# Altium schematic sheet 0_Overview.SchDoc
size A4; SheetNumber: 1; SheetTotal: 6
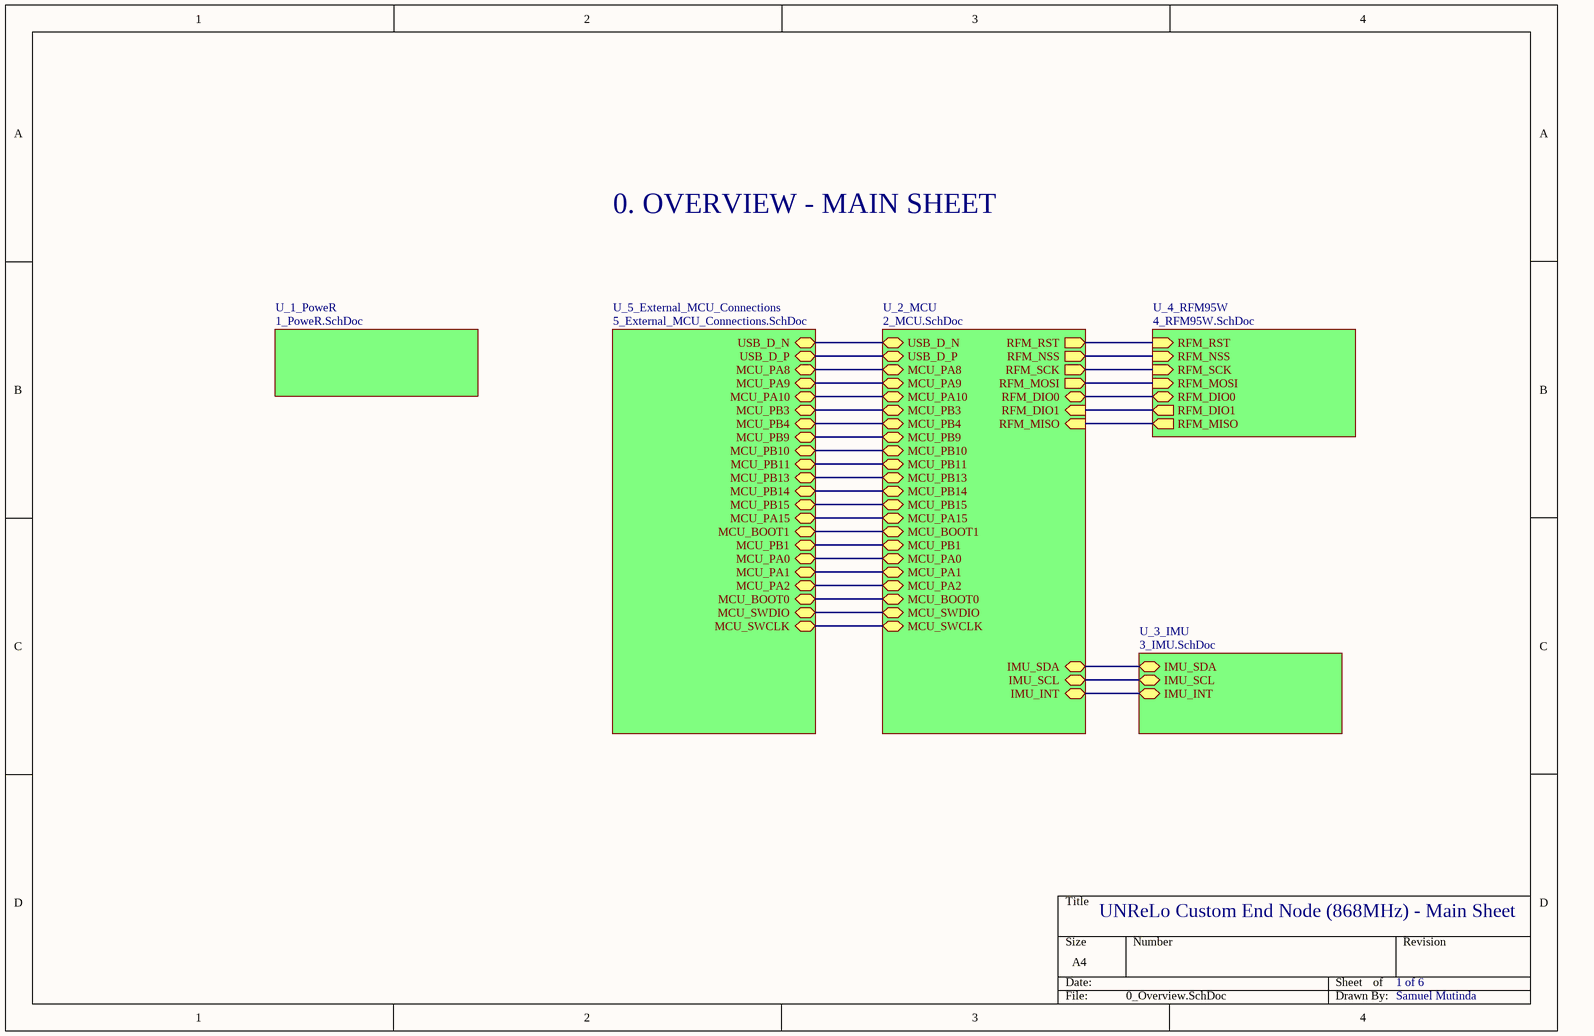
[diagram p0: 0_Overview.SchDoc]

## Sub-sheets
U_1_PoweR = 1_PoweR.SchDoc: no entries
U_2_MCU = 2_MCU.SchDoc: RFM_DIO0 (bidir), RFM_RST (out), RFM_NSS (out), RFM_SCK (out), RFM_MOSI (out), RFM_MISO (in), RFM_DIO1 (in), USB_D_N (bidir), USB_D_P (bidir), MCU_PA8 (bidir), MCU_PA9 (bidir), MCU_PA10 (bidir), MCU_PB3 (bidir), MCU_PB4 (bidir), MCU_PB9 (bidir), MCU_PB10 (bidir), MCU_PB11 (bidir), MCU_PB13 (bidir), MCU_PB14 (bidir), MCU_PB15 (bidir), MCU_PA15 (bidir), MCU_BOOT1 (bidir), MCU_PB1 (bidir), MCU_PA0 (bidir), MCU_PA1 (bidir), MCU_PA2 (bidir), MCU_BOOT0 (bidir), MCU_SWDIO (bidir), MCU_SWCLK (bidir), IMU_SCL (bidir), IMU_SDA (bidir), IMU_INT (bidir)
U_3_IMU = 3_IMU.SchDoc: IMU_SDA (bidir), IMU_SCL (bidir), IMU_INT (bidir)
U_4_RFM95W = 4_RFM95W.SchDoc: RFM_RST (in), RFM_NSS (in), RFM_SCK (in), RFM_MOSI (in), RFM_MISO (out), RFM_DIO0 (bidir), RFM_DIO1 (out)
U_5_External_MCU_Connections = 5_External_MCU_Connections.SchDoc: USB_D_N (bidir), USB_D_P (bidir), MCU_PA0 (bidir), MCU_PA1 (bidir), MCU_PA2 (bidir), MCU_PB1 (bidir), MCU_PB9 (bidir), MCU_PB10 (bidir), MCU_PB11 (bidir), MCU_PB13 (bidir), MCU_PB14 (bidir), MCU_PB15 (bidir), MCU_PB3 (bidir), MCU_PB4 (bidir), MCU_PA10 (bidir), MCU_PA9 (bidir), MCU_PA8 (bidir), MCU_BOOT0 (bidir), MCU_BOOT1 (bidir), MCU_SWDIO (bidir), MCU_SWCLK (bidir), MCU_PA15 (bidir)

## Nets
(unnamed): sheet U_2_MCU/RFM_DIO0, sheet U_4_RFM95W/RFM_DIO0
(unnamed): sheet U_2_MCU/RFM_RST, sheet U_4_RFM95W/RFM_RST
(unnamed): sheet U_2_MCU/RFM_NSS, sheet U_4_RFM95W/RFM_NSS
(unnamed): sheet U_2_MCU/RFM_SCK, sheet U_4_RFM95W/RFM_SCK
(unnamed): sheet U_2_MCU/RFM_MOSI, sheet U_4_RFM95W/RFM_MOSI
(unnamed): sheet U_2_MCU/RFM_MISO, sheet U_4_RFM95W/RFM_MISO
(unnamed): sheet U_2_MCU/RFM_DIO1, sheet U_4_RFM95W/RFM_DIO1
(unnamed): sheet U_2_MCU/USB_D_N, sheet U_5_External_MCU_Connections/USB_D_N
(unnamed): sheet U_2_MCU/USB_D_P, sheet U_5_External_MCU_Connections/USB_D_P
(unnamed): sheet U_2_MCU/MCU_PA8, sheet U_5_External_MCU_Connections/MCU_PA8
(unnamed): sheet U_2_MCU/MCU_PA9, sheet U_5_External_MCU_Connections/MCU_PA9
(unnamed): sheet U_2_MCU/MCU_PA10, sheet U_5_External_MCU_Connections/MCU_PA10
(unnamed): sheet U_2_MCU/MCU_PB3, sheet U_5_External_MCU_Connections/MCU_PB3
(unnamed): sheet U_2_MCU/MCU_PB4, sheet U_5_External_MCU_Connections/MCU_PB4
(unnamed): sheet U_2_MCU/MCU_PB9, sheet U_5_External_MCU_Connections/MCU_PB9
(unnamed): sheet U_2_MCU/MCU_PB10, sheet U_5_External_MCU_Connections/MCU_PB10
(unnamed): sheet U_2_MCU/MCU_PB11, sheet U_5_External_MCU_Connections/MCU_PB11
(unnamed): sheet U_2_MCU/MCU_PB13, sheet U_5_External_MCU_Connections/MCU_PB13
(unnamed): sheet U_2_MCU/MCU_PB14, sheet U_5_External_MCU_Connections/MCU_PB14
(unnamed): sheet U_2_MCU/MCU_PB15, sheet U_5_External_MCU_Connections/MCU_PB15
(unnamed): sheet U_2_MCU/MCU_PA15, sheet U_5_External_MCU_Connections/MCU_PA15
(unnamed): sheet U_2_MCU/MCU_BOOT1, sheet U_5_External_MCU_Connections/MCU_BOOT1
(unnamed): sheet U_2_MCU/MCU_PB1, sheet U_5_External_MCU_Connections/MCU_PB1
(unnamed): sheet U_2_MCU/MCU_PA0, sheet U_5_External_MCU_Connections/MCU_PA0
(unnamed): sheet U_2_MCU/MCU_PA1, sheet U_5_External_MCU_Connections/MCU_PA1
(unnamed): sheet U_2_MCU/MCU_PA2, sheet U_5_External_MCU_Connections/MCU_PA2
(unnamed): sheet U_2_MCU/MCU_BOOT0, sheet U_5_External_MCU_Connections/MCU_BOOT0
(unnamed): sheet U_2_MCU/MCU_SWDIO, sheet U_5_External_MCU_Connections/MCU_SWDIO
(unnamed): sheet U_2_MCU/MCU_SWCLK, sheet U_5_External_MCU_Connections/MCU_SWCLK
(unnamed): sheet U_2_MCU/IMU_SCL, sheet U_3_IMU/IMU_SCL
(unnamed): sheet U_2_MCU/IMU_SDA, sheet U_3_IMU/IMU_SDA
(unnamed): sheet U_2_MCU/IMU_INT, sheet U_3_IMU/IMU_INT

## Notes on the sheet
- 0. OVERVIEW - MAIN SHEET
- UNReLo Custom End Node (868MHz) - Main Sheet
- 1 of 6
- Samuel Mutinda